# Altium schematic sheet Miscellaneous.SchDoc: Miscellaneous
size Letter; SheetNumber: 6; SheetTotal: 11
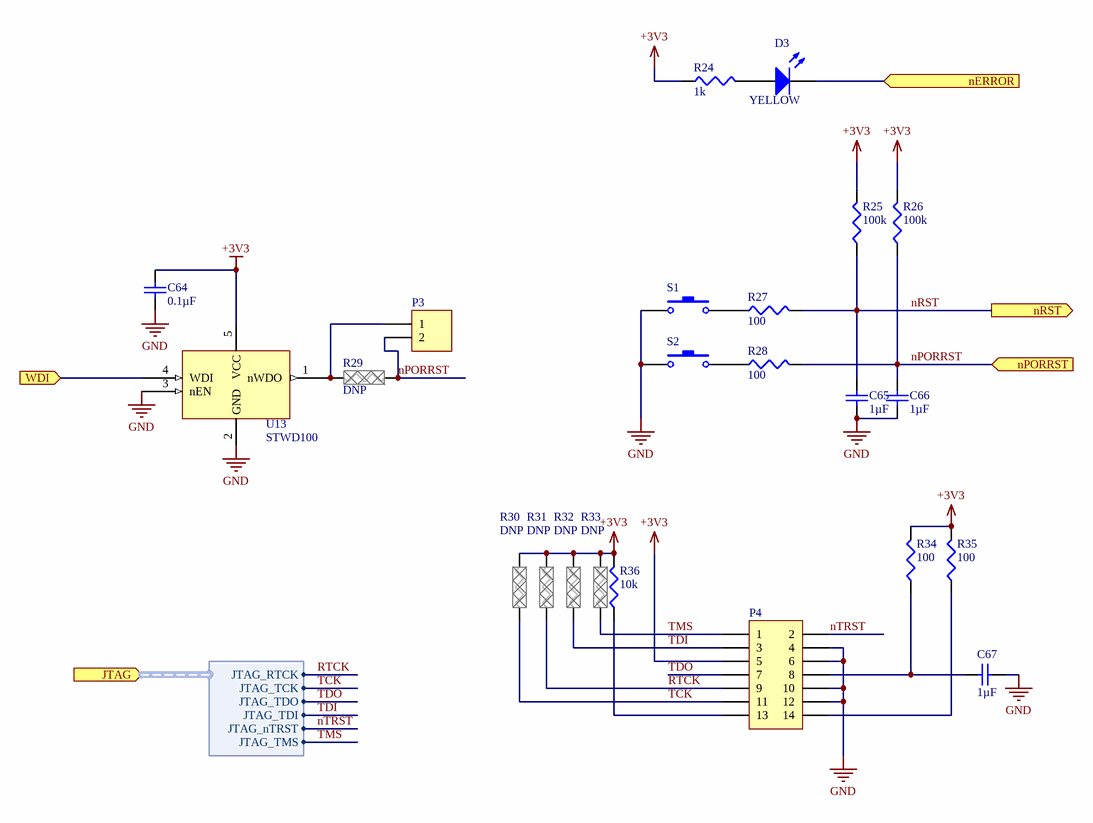
[diagram p0: Miscellaneous.SchDoc]

## Parts
C64  value 0.1µF  [TDK-CGA2B]  (hidden comment: Cap)
C65  value 1µF  [TDK-CGA3E]  (hidden comment: Cap)
C66  value 1µF  [TDK-CGA3E]  (hidden comment: Cap)
C67  value 1µF  [TDK-CGA3E]  (hidden comment: Cap)
D3  value YELLOW  [WL-150060XS75000]  (hidden comment: LED)
P3  Header 2  [SLN-GRPB021]  (value not drawn)
P4  Header 7x2  [HDR2X7]  (value not drawn)
R24  value 1k  [PANA-ERJ3EK]  (hidden comment: Res3)
R25  value 100k  [PANA-ERJ2R]  (hidden comment: Res3)
R26  value 100k  [PANA-ERJ2R]  (hidden comment: Res3)
R27  value 100  [PANA-ERJ2R]  (hidden comment: Res3)
R28  value 100  [PANA-ERJ2R]  (hidden comment: Res3)
R29  DNP  [PANA-ERA2A]  (no BOM)
R30  DNP  [PANA-ERA2A]  (no BOM)
R31  DNP  [PANA-ERA2A]  (no BOM)
R32  DNP  [PANA-ERA2A]  (no BOM)
R33  DNP  [PANA-ERA2A]  (no BOM)
R34  value 100  [PANA-ERJ2R]  (hidden comment: Res3)
R35  value 100  [PANA-ERJ2R]  (hidden comment: Res3)
R36  value 10k  [PANA-ERA2A]  (hidden comment: Res3)
S1  1825910-7  [TEC-1825910-7]  (value not drawn)
S2  1825910-7  [TEC-1825910-7]  (value not drawn)
U13  STWD100  [STM-SOT235]

## Ports
JTAG (in, harness TMS570_JTAG), nERROR (in), nPORRST (in), nRST (out), WDI (in)

## Harnesses
TMS570_JTAG: JTAG_TMS, JTAG_TCK, JTAG_TDO, JTAG_TDI, JTAG_nTRST, JTAG_RTCK

## Nets
+3V3: C64.1 P4.5 R24.1 R25.2 R26.2 R30.2 R31.2 R32.2 R33.2 R34.2 R35.2 R36.2 U13.5(VCC)
GND: C64.2 C65.1 C66.1 C67.1 P4.4 P4.6 P4.10 P4.12 S1.1 S2.1 U13.2(GND) U13.3(nEN)
nERROR: D3.2(K) ; port nERROR
nPORRST: C66.2 P3.2 R26.1 R28.2 R29.1 ; port nPORRST
nRST: C65.2 R25.1 R27.2 ; port nRST
nTRST: P4.2 ; port JTAG.JTAG_nTRST
RTCK: P4.9 R31.1 ; port JTAG.JTAG_RTCK
TCK: P4.11 R30.1 ; port JTAG.JTAG_TCK
TDI: P4.3 R32.1 ; port JTAG.JTAG_TDI
TDO: P4.7 ; port JTAG.JTAG_TDO
TMS: P4.1 R33.1 ; port JTAG.JTAG_TMS
WDI: U13.4(WDI) ; port WDI
NetC67_2: C67.2 P4.8 R34.1
NetD3_1: D3.1(A) R24.2
NetP3_1: P3.1 R29.2 U13.1(nWDO)
NetP4_13: P4.13 R36.1
NetP4_14: P4.14 R35.1
NetR27_1: R27.1 S1.2
NetR28_1: R28.1 S2.2

## Notes on the sheet
- (the "License"); you may not use or redistribute this file except in compliance with the License. You
- This file and the information within it are licensed under the terms of the Apache License, Version 2.0
- Copyright
- Unless required by applicable law or agreed to in writing, content distributed under the License is
- distributed on an "AS IS" BASIS, WITHOUT WARRANTIES OR CONDITIONS OF ANY KIND,
- either express or implied. See the License for the specific language governing permissions and
- limitations under the License.
- may obtain a copy of the License at:
- http://www.apache.org/licenses/LICENSE-2.0
- Title
- Size:
- Date:
- Letter
- Number:
- Time:
- Revision:
- Sheet
- of
- University of Alberta
- Deptartment of Electrical
- and Computer Engineering
- Edmonton AB, Canada
- T6G 1H9
- File:

## Library data of the parts
C64 = PC-TDK-02259: CAP CER 0.1UF 50V X7R 0402; Manufacturer Part Number: CGA2B3X7R1H104K050BB; Index: 2259; Designator: C?; Tolerance: ±10%; Published: 2016-03-16; LatestRevisionDate: 2016-03-16; LatestRevisionNote: ...; PackageReference: 0402 (1005 Metric); Publisher: AlbertaSat; PackageDescription: Radial Cap, Thru-Hole; 2 Leads; 0.3 in Pin Spacing; Part Number: PC-TDK-02259; Supplier Part Number 1: 445-6899-1-ND; Supplier 1: Digi-key; Supplier Link: http://www.digikey.ca/product-search/en?keywords=445-6899-1-ND; Voltage - Rated: 50V; Temperature Coefficient: X7R; Applications: Automotive
C65-C67 = PC-TDK-02601: CAP CER 1UF 16V X5R 0603; Manufacturer Part Number: CGA3E1X5R1C105K080AC; Index: 2601; Designator: C?; Tolerance: ±10%; Published: 2016-03-16; LatestRevisionDate: 2016-03-16; LatestRevisionNote: ...; PackageReference: 0603 (1608 Metric); Publisher: AlbertaSat; PackageDescription: Radial Cap, Thru-Hole; 2 Leads; 0.3 in Pin Spacing; Part Number: PC-TDK-02601; Supplier Part Number 1: 445-12457-1-ND; Supplier 1: Digi-key; Supplier Link: http://www.digikey.ca/product-search/en?keywords=445-12457-1-ND; Voltage - Rated: 16V; Temperature Coefficient: X5R; Applications: Automotive
D3 = 5: LED YELLOW CLEAR 0603 SMD; Part Number: 5; Manufacturer Part Number: 150060YS75000; Designator: D?; Brightness: 120mcd; Published: 8-Jun-2000; LatestRevisionDate: 08-Jul-2005; LatestRevisionNote: Mech Layer 1 removed.; PackageReference: WL-150060XS75000; Publisher: Altium Limited; PackageDescription: LED; 2 Leads; Supplier Part Number 1: 732-4981-1-ND; Supplier 1: Digi-Key; Supplier Link: http://www.digikey.ca/product-search/en?keywords=732-4981-1-ND
P3 = PP-SLN-00001: CONN HEADER .050"" 3POS PCB GOLD; Manufacturer Part Number: GRPB021VWVN-RC; Index: 1; Designator: P?; Number of Positions: 2; Pitch: 0.050" (1.27mm); LatestRevisionDate: 2016-03-15; LatestRevisionNote: ...; Publisher: AlbertaSat; Part Number: PP-SLN-00001; Supplier Part Number 1: S9014E-02-ND; Supplier 1: Digi-key; Published: 2016-03-15; PackageReference: SLN-GRPB021; PackageDescription: CONN HEADER .050"" 3POS PCB GOLD; Supplier Link: http://www.digikey.ca/product-search/en?keywords=S9014E-02-ND; Number of Rows: 1
P4 = PP-SLN-00068: CONN HEADER .100"" DUAL STR 14POS; Manufacturer Part Number: PRPC007DAAN-RC; Index: 68; Designator: P?; Number of Positions: 14; Pitch: 0.100" (2.54mm); Post Length: 0.120" (3.05mm); Mating Length: 0.230" (5.84mm); LatestRevisionDate: 2017-03-17; LatestRevisionNote: ...; Publisher: AlbertaSat; Part Number: PP-SLN-00068; Supplier Part Number 1: S2011EC-07-ND; Supplier 1: Digi-key; Published: 2017-03-17; PackageReference: SLN-PRPC007DAA; PackageDescription: CONN HEADER .100"" DUAL STR 14POS; Supplier Link: http://www.digikey.ca/product-search/en?keywords=S2011EC-07-ND; Number of Rows: 2; Mounting Type: Through Hole
R24 = 15398: RES SMD 1K OHM 1% 1/10W 0603; Part Number: 15398; Manufacturer Part Number: ERJ-3EKF1001V; Designator: R?; Power: 0.1W, 1/10W; Temperature Coefficient: ±100ppm/°C; Published: 8-Jun-2000; LatestRevisionDate: 29-May-2009; LatestRevisionNote: IPC-7351 Footprint Added.; PackageReference: 0603 (1608 Metric); Publisher: Altium Limited; PackageDescription: Chip Resistor, 2-Leads, Body 1.60x0.80mm, IPC Low Density; Supplier Part Number 1: P1.00KHCT-ND; Supplier 1: Digi-Key; Supplier Link: http://www.digikey.ca/product-search/en?keywords=P1.00KHCT-ND; Tolerance: ±1%
R25 R26 = 18739: RES SMD 100K OHM 1% 1/10W 0402; Part Number: 18739; Manufacturer Part Number: ERJ-2RKF1003X; Designator: R?; Power: 0.1W, 1/10W; Temperature Coefficient: ±100ppm/°C; Published: 8-Jun-2000; LatestRevisionDate: 29-May-2009; LatestRevisionNote: IPC-7351 Footprint Added.; PackageReference: 0402 (1005 Metric); Publisher: Altium Limited; PackageDescription: Chip Resistor, 2-Leads, Body 1.00x0.50mm, IPC Low Density; Supplier Part Number 1: P100KLCT-ND; Supplier 1: Digi-Key; Supplier Link: http://www.digikey.ca/product-search/en?keywords=P100KLCT-ND; Tolerance: ±1%
R27 R28 R34 R35 = 14081: RES SMD 100 OHM 1% 1/10W 0402; Part Number: 14081; Manufacturer Part Number: ERJ-2RKF1000X; Designator: R?; Power: 0.1W, 1/10W; Temperature Coefficient: ±100ppm/°C; Published: 8-Jun-2000; LatestRevisionDate: 29-May-2009; LatestRevisionNote: IPC-7351 Footprint Added.; PackageReference: 0402 (1005 Metric); Publisher: Altium Limited; PackageDescription: Chip Resistor, 2-Leads, Body 1.00x0.50mm, IPC Low Density; Supplier Part Number 1: P100LCT-ND; Supplier 1: Digi-Key; Supplier Link: http://www.digikey.ca/product-search/en?keywords=P100LCT-ND; Tolerance: ±1%
R29-R33 = 19768: Part Number: 19768; Designator: R?; Value: DNP; PackageReference: 0402 (1005 Metric); PackageDescription: Chip Resistor, 2-Leads, Body 1.00x0.50mm, IPC Low Density
R36 = 17196: RES SMD 10K OHM 0.25% 1/16W 0402; Part Number: 17196; Manufacturer Part Number: ERA-2ARC103X; Designator: R?; Power: 0.063W, 1/16W; Temperature Coefficient: ±10ppm/°C; Published: 8-Jun-2000; LatestRevisionDate: 29-May-2009; LatestRevisionNote: IPC-7351 Footprint Added.; PackageReference: 0402 (1005 Metric); Publisher: Altium Limited; PackageDescription: Chip Resistor, 2-Leads, Body 1.00x0.50mm, IPC Low Density; Supplier Part Number 1: P10KCQCT-ND; Supplier 1: Digi-Key; Supplier Link: http://www.digikey.ca/product-search/en?keywords=P10KCQCT-ND; Tolerance: ±0.25%
S1 S2 = 452: SWITCH TACTILE SPST-NO 0.05A 24V; Part Number: 452; Designator: S?; Power (Watts): 1.2W; Published: 24-Mar-1999; LatestRevisionDate: 17-Jul-2002; LatestRevisionNote: Re-released for DXP Platform.; PackageReference: 1825910-7; Publisher: Altium Limited; PackageDescription: Tactile Switch SPST-NO Top Actuated Through Hole; Manufacturer Part Number: 1825910-7; Supplier Part Number 1: 450-1804-ND; Supplier 1: Digi-Key; Supplier Link: http://www.digikey.ca/product-search/en?keywords=450-1804-ND
U13 = PU-STM-00004: IC WATCHDOG TIME CIRCUIT SOT23-5; Manufacturer Part Number: STWD100YNWWY3F; Index: 4; Designator: U?; Value: 5.1 ms; Output Type: Open Drain; Part Number: PU-STM-00004; Supplier Part Number 1: 497-14864-1-ND; Supplier 1: Digi-key; Supplier Part Number 2: 511-STWD100YNWWY3F; Supplier 2: Mouser; Publisher: AlbertaSat; Published: 2017-04-06; LatestRevisionDate: 2017-04-06; LatestRevisionNote: ...; PackageReference: SOT-23-5; Supplier Link: https://www.digikey.ca/product-search/en?keywords=497-14864-1-ND